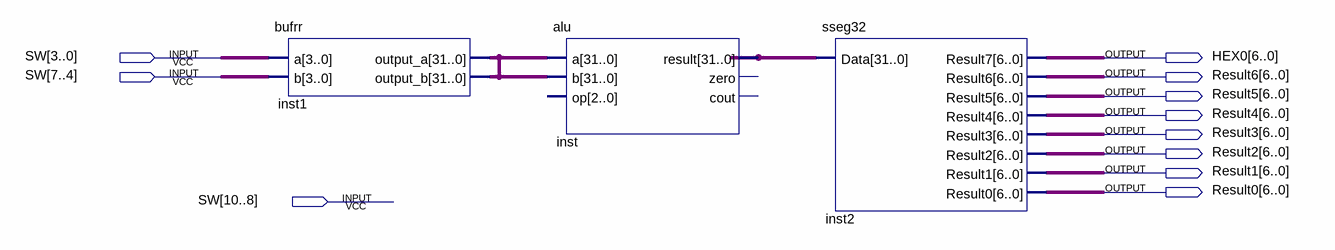
[diagram p0: schematic sheet]
// Quartus schematic Block1.bdf as structural Verilog: 3 symbols, 11 pins
module Block1 (
  input  [10:0] SW,
  output [6:0] HEX0,
  output [6:0] Result6,
  output [6:0] Result5,
  output [6:0] Result4,
  output [6:0] Result3,
  output [6:0] Result2,
  output [6:0] Result1,
  output [6:0] Result0
);

  wire [31:0] inst1_output_a, inst_result;

  bufrr inst1 (.a(SW[3:0]), .b(SW[7:4]), .output_a(inst1_output_a), .output_b(inst1_output_a));
  alu inst (.a(inst1_output_a), .b(inst1_output_a), .result(inst_result));  // open: op, zero, cout
  sseg32 inst2 (
    .Data(inst_result), .Result7(HEX0), .Result6(Result6), .Result5(Result5), .Result4(Result4),
    .Result3(Result3), .Result2(Result2), .Result1(Result1), .Result0(Result0));
endmodule
